# Altium schematic sheet InputPort.SchDoc
size A4
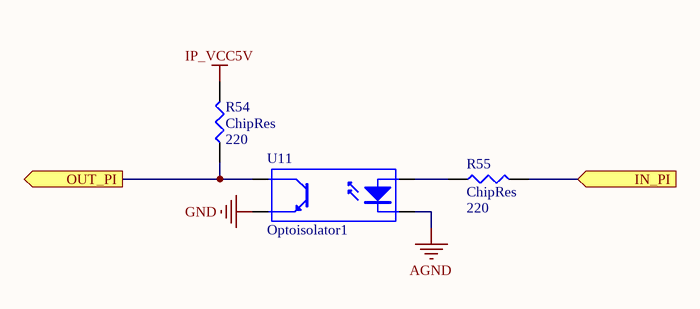
[diagram p0: InputPort.SchDoc]

## Parts
R54  ChipRes  value 220  [RES0805]
R55  ChipRes  value 220  [RES0805]
U11  Optoisolator1  [DIP-4]

## Ports
IN_PI (in), OUT_PI (out)

## Nets
AGND: U11.2(K)
GND: U11.3(E)
IP_VCC5V: R54.2
IN_PI: R55.2 ; port IN_PI
OUT_PI: R54.1 U11.4(C) ; port OUT_PI
NetR55_1: R55.1 U11.1(A)

## Library data of the parts
R54 R55 = ChipRes: Chip resistor
U11 = Optoisolator1: 4-Pin Phototransistor Optocoupler; Published: 24-Mar-1999; LatestRevisionDate: 04-Mar-2005; LatestRevisionNote: Sch pins 3 & 4 Swapped.; DatasheetVersion: Nov-2003; PackageReference: DIP-4; Publisher: Altium Limited